# Altium schematic sheet POWR0001_BCR_LT1513.SchDoc: BLUEsat Battery Charge Regulator
size A3; Engineer: Thomas Fisk; Organization: BLUEsat Project; Address1: Room 419; Address2: School of EE&T; Address3: UNSW, NSW 2052; Address4: Australia; DocumentNumber: POWR0001; Revision: 2; SheetNumber: 1; SheetTotal: 1; Description: SEPIC battery charge regulator with variable current control; Version: 4; PageSetup: Record=PageOptions|CenterHorizontal=True|CenterVertical=True|PrintScale=0.71|XCorrection=1.00|YCorrection=1.00|PrintKind=1|BorderSize=5000000|LeftOffset=0|BottomOffset=0|Orientation=2|PaperLength=1000|PaperWidth=1000|Scale=100|PaperSource=7|PrintQuality=1200|MediaType=1|DitherType=10|PaperKind=A4|PrintScaleMode=1
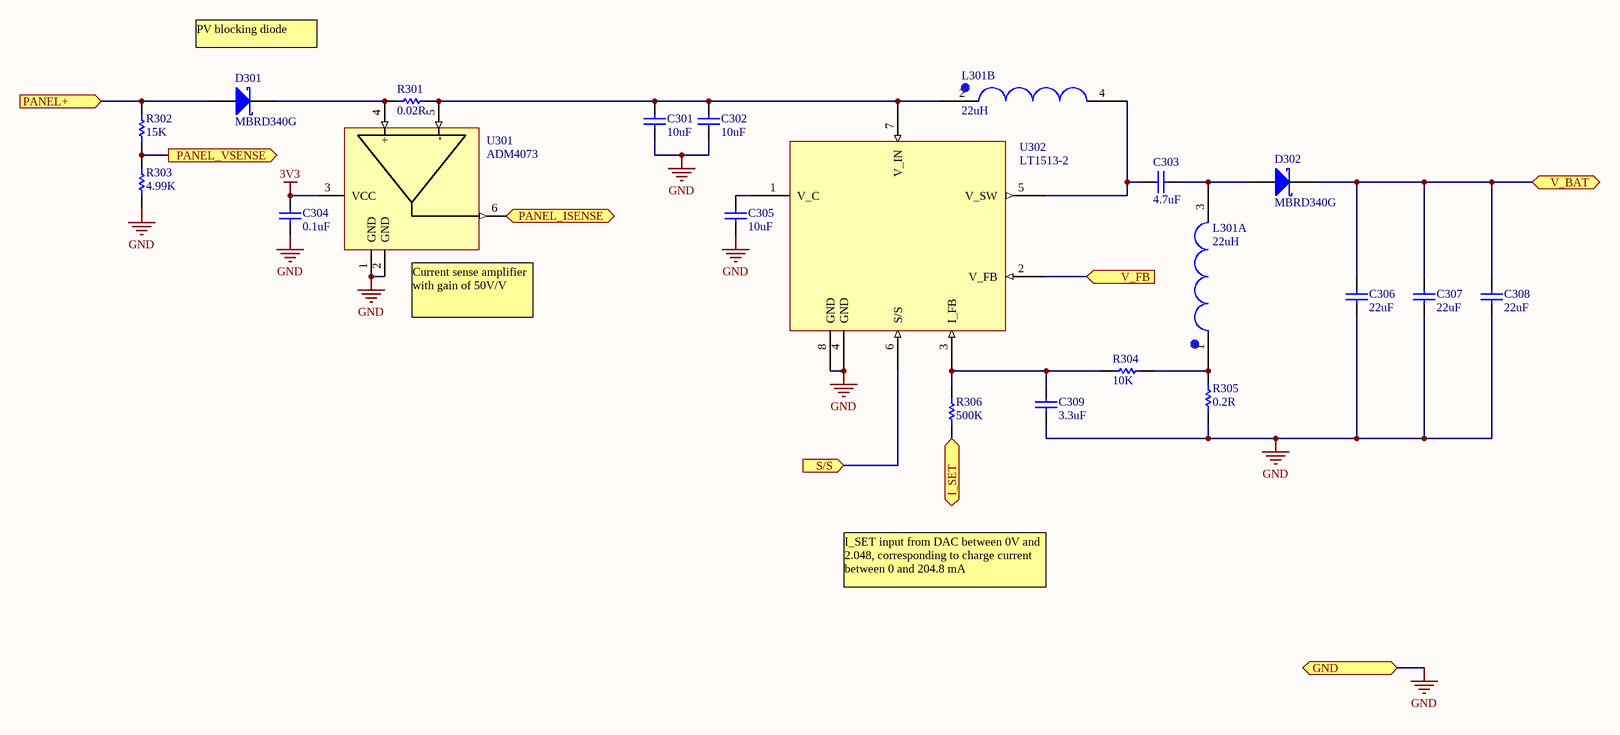
[diagram p0: POWR0001_BCR_LT1513.SchDoc]

## Parts
C301  value 10uF  [CAPC3225M]  (hidden comment: Cap)
C302  value 10uF  [CAPC3225M]  (hidden comment: Cap)
C303  value 4.7uF  [CAPC3225M]  (hidden comment: Cap)
C304  value 0.1uF  [CAPC2012M]  (hidden comment: Cap)
C305  value 10uF  [CAPC3216M]  (hidden comment: Cap)
C306  value 22uF  [CAPC4532M]  (hidden comment: Cap)
C307  value 22uF  [CAPC4532M]  (hidden comment: Cap)
C308  value 22uF  [CAPC4532M]  (hidden comment: Cap)
C309  value 3.3uF  [CAPC3216M]  (hidden comment: Cap)
D301  MBRD340G  [TO229P990X238-3N]
D302  MBRD340G  [TO229P990X238-3N]
L301  value 22uH  [DRQ125]  (hidden comment: DRQ125 Dual Inductor)  (parts A,B of 2)
R301  value 0.02R  [RESC2012M]  (hidden comment: Res1)
R302  value 15K  [RESC2012M]  (hidden comment: Res1)
R303  value 4.99K  [RESC2012M]  (hidden comment: Res1)
R304  value 10K  [RESC2012M]  (hidden comment: Res1)
R305  value 0.2R  [RESC2012M]  (hidden comment: Res1)
R306  value 500K  [RESC2012M]  (hidden comment: Res1)
U301  ADM4073  [SOT26A-6N]
U302  LT1513-2  [LT1513-2_TO127P1420-8N]

## Ports
GND, I_SET (in), PANEL+ (in), PANEL_ISENSE (out), PANEL_VSENSE (out), S/S (in), V_BAT, V_FB (in)

## Nets
3V3: C304.1 U301.3(VCC)
GND: C301.2 C302.2 C304.2 C305.2 C306.2 C307.2 C308.2 C309.1 R303.1 R305.1 U301.1(GND) U301.2(GND) U302.4(GND) U302.8(GND) ; port GND
I_SET: R306.2 ; port I_SET
PANEL+: D301.1(A) R302.2 ; port PANEL+
PANEL_ISENSE: U301.6 ; port PANEL_ISENSE
PANEL_VSENSE: R302.1 R303.2 ; port PANEL_VSENSE
S/S: U302.6(S/S) ; port S/S
V_BAT: C306.1 C307.1 C308.1 D302.2(K) ; port V_BAT
V_FB: U302.2(V_FB) ; port V_FB
NetC301_1: C301.1 C302.1 L301.2 R301.1 U301.5(-) U302.7(V_IN)
NetC303_1: C303.1 D302.1(A) L301.3
NetC303_2: C303.2 L301.4 U302.5(V_SW)
NetC305_1: C305.1 U302.1(V_C)
NetC309_2: C309.2 R304.2 R306.1 U302.3(I_FB)
NetD301_2: D301.2(K) R301.2 U301.4(+)
NetL301_1: L301.1 R304.1 R305.2

## Notes on the sheet
- PV blocking diode
- (near U301) Current sense amplifier with gain of 50V/V
- I_SET input from DAC between 0V and 2.048, corresponding to charge current between 0 and 204.8 mA
- Title
- Description:
- Size:
- Author:
- Date:
- A3
- Time:
- Version
- Sheet:
- Drawing No.:
- of
- File:

## Library data of the parts
C301-C309 = Cap: Capacitor; Published: 8-Jun-2000; LatestRevisionDate: 17-Jul-2002; LatestRevisionNote: Re-released for DXP Platform.; PackageReference: RAD-0.3; Publisher: Altium Limited; PackageDescription: Radial Cap, Thru-Hole; 2 Leads; 0.3 in Pin Spacing; Supplier 1: Farnell; Supplier 2: Farnell
  C301 C302: Supplier Part Number 2: 1844365
  C303: Supplier Part Number 2: 1844381
  C304 C305: Supplier Part Number 2: 1759265
  C306-C308: Supplier Part Number 2: 1844378
  C309: Supplier Part Number 2: 1168132
D301 D302 = Diode 11DQ03: Schottky Rectifier; Published: 8-Jun-2000; LatestRevisionDate: 17-Jul-2002; LatestRevisionNote: Re-released for DXP Platform.; DatasheetVersion: Dec-1997; PackageReference: DO-204AL; Publisher: Altium Limited; PackageDescription: Diode, Axial; Body 5.2 x 2.7 mm (LxDia. max), Lead Dia. 0.86 mm (max); Code_JEDEC: DO-204-AL; ComponentLink1Description: Manufacturer Link; ComponentLink1URL: http://www.irf.com/; ComponentLink2Description: Datasheet; ComponentLink2URL: http://www.irf.com/product-info/datasheets/data/11dq03.pdf; Supplier 1: Farnell; Supplier Part Number 1: 1431096
R301-R306 = Res1: Resistor; Published: 8-Jun-2000; LatestRevisionDate: 17-Jul-2002; LatestRevisionNote: Re-released for DXP Platform.; PackageReference: AXIAL-0.3; Publisher: Altium Limited; PackageDescription: Axial Device, Thru-Hole; 2 Leads; 0.3 in Pin Spacing; Supplier 1: Farnell
U301 = ADM4073: Current Sense Amplifer